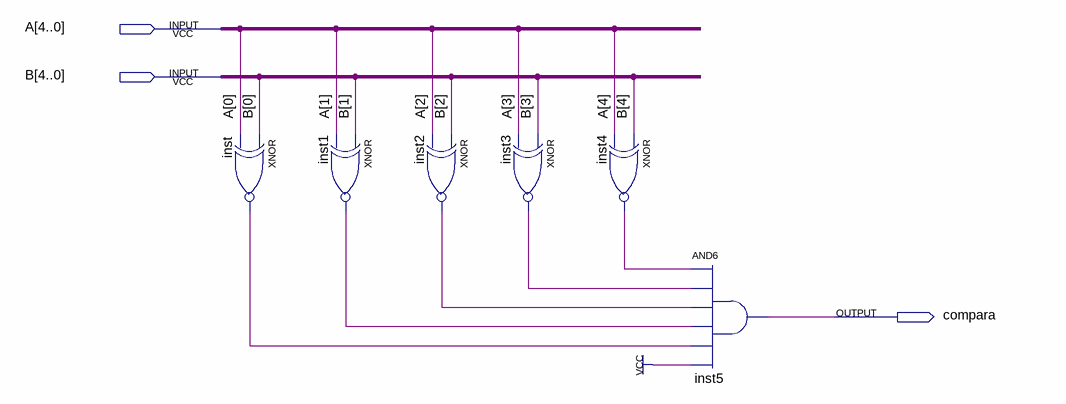
[diagram p0: schematic sheet]
// Quartus schematic comparador.bdf as structural Verilog: 6 symbols, 3 pins
module comparador (
  input  [4:0] A,
  input  [4:0] B,
  output compara
);

  wire inst1_out, inst2_out, inst3_out, inst4_out, inst_out;

  xnor inst (inst_out, B[0], A[0]);
  xnor inst1 (inst1_out, B[1], A[1]);
  xnor inst2 (inst2_out, B[2], A[2]);
  xnor inst3 (inst3_out, B[3], A[3]);
  xnor inst4 (inst4_out, B[4], A[4]);
  and inst5 (compara, inst4_out, inst3_out, inst2_out, inst1_out, inst_out, 1'b1);
endmodule
